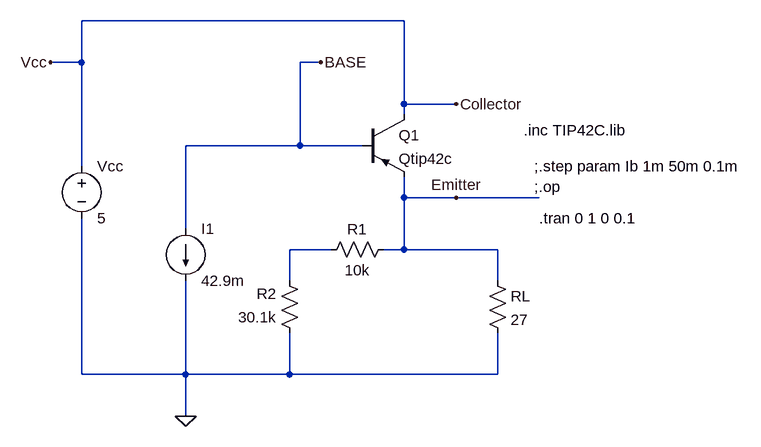
[diagram p0: schematic Stage04_TB_TIP42C.asc]
Stage04_TB_TIP42C.asc, the LTspice schematic file:
Version 4.1
SHEET 1 1788 716
WIRE 224 -48 -272 -48
WIRE -272 16 -272 -48
WIRE -272 16 -320 16
WIRE 96 16 64 16
WIRE 224 80 224 -48
WIRE 304 80 224 80
WIRE 224 96 224 80
WIRE 64 144 64 16
WIRE 64 144 -112 144
WIRE 160 144 64 144
WIRE -272 176 -272 16
WIRE 224 224 224 192
WIRE 304 224 224 224
WIRE 432 224 304 224
WIRE -112 272 -112 144
WIRE 112 304 48 304
WIRE 224 304 224 224
WIRE 224 304 192 304
WIRE 368 304 224 304
WIRE 48 352 48 304
WIRE 368 352 368 304
WIRE -272 496 -272 256
WIRE -112 496 -112 352
WIRE -112 496 -272 496
WIRE 48 496 48 432
WIRE 48 496 -112 496
WIRE 368 496 368 432
WIRE 368 496 48 496
WIRE -112 560 -112 496
FLAG -112 560 0
FLAG 96 16 BASE
FLAG -320 16 Vcc
FLAG 304 80 Collector
FLAG 304 224 Emitter
DATAFLAG 112 144 "-Ib(Q1)"
SYMBOL pnp 160 96 R0
SYMATTR InstName Q1
SYMATTR Value Qtip42c
SYMBOL voltage -272 160 R0
SYMATTR InstName Vcc
SYMATTR Value 5
SYMBOL res 352 336 R0
SYMATTR InstName RL
SYMATTR Value 27
SYMBOL res 208 288 R90
WINDOW 0 0 56 VBottom 2
WINDOW 3 32 56 VTop 2
SYMATTR InstName R1
SYMATTR Value 10k
SYMBOL res 64 448 R180
WINDOW 0 36 76 Left 2
WINDOW 3 36 40 Left 2
SYMATTR InstName R2
SYMATTR Value 30.1k
SYMBOL current -112 272 R0
SYMATTR InstName I1
SYMATTR Value 42.9m
TEXT 408 120 Left 2 !.inc TIP42C.lib
TEXT 424 176 Left 2 !;.step param Ib 1m 50m 0.1m\n;.op
TEXT 432 256 Left 2 !.tran 0 1 0 0.1

The netlist it stands for:
* Stage04_TB_TIP42C.asc
Q1 Collector BASE Emitter 0 Qtip42c
Vcc Collector 0 5
RL Emitter 0 27
R1 Emitter N001 10k
R2 0 N001 30.1k
I1 BASE 0 42.9m
.model NPN NPN
.model PNP PNP
.lib standard.bjt
.inc TIP42C.lib
;.step param Ib 1m 50m 0.1m
;.op
.tran 0 1 0 0.1
.backanno
.end